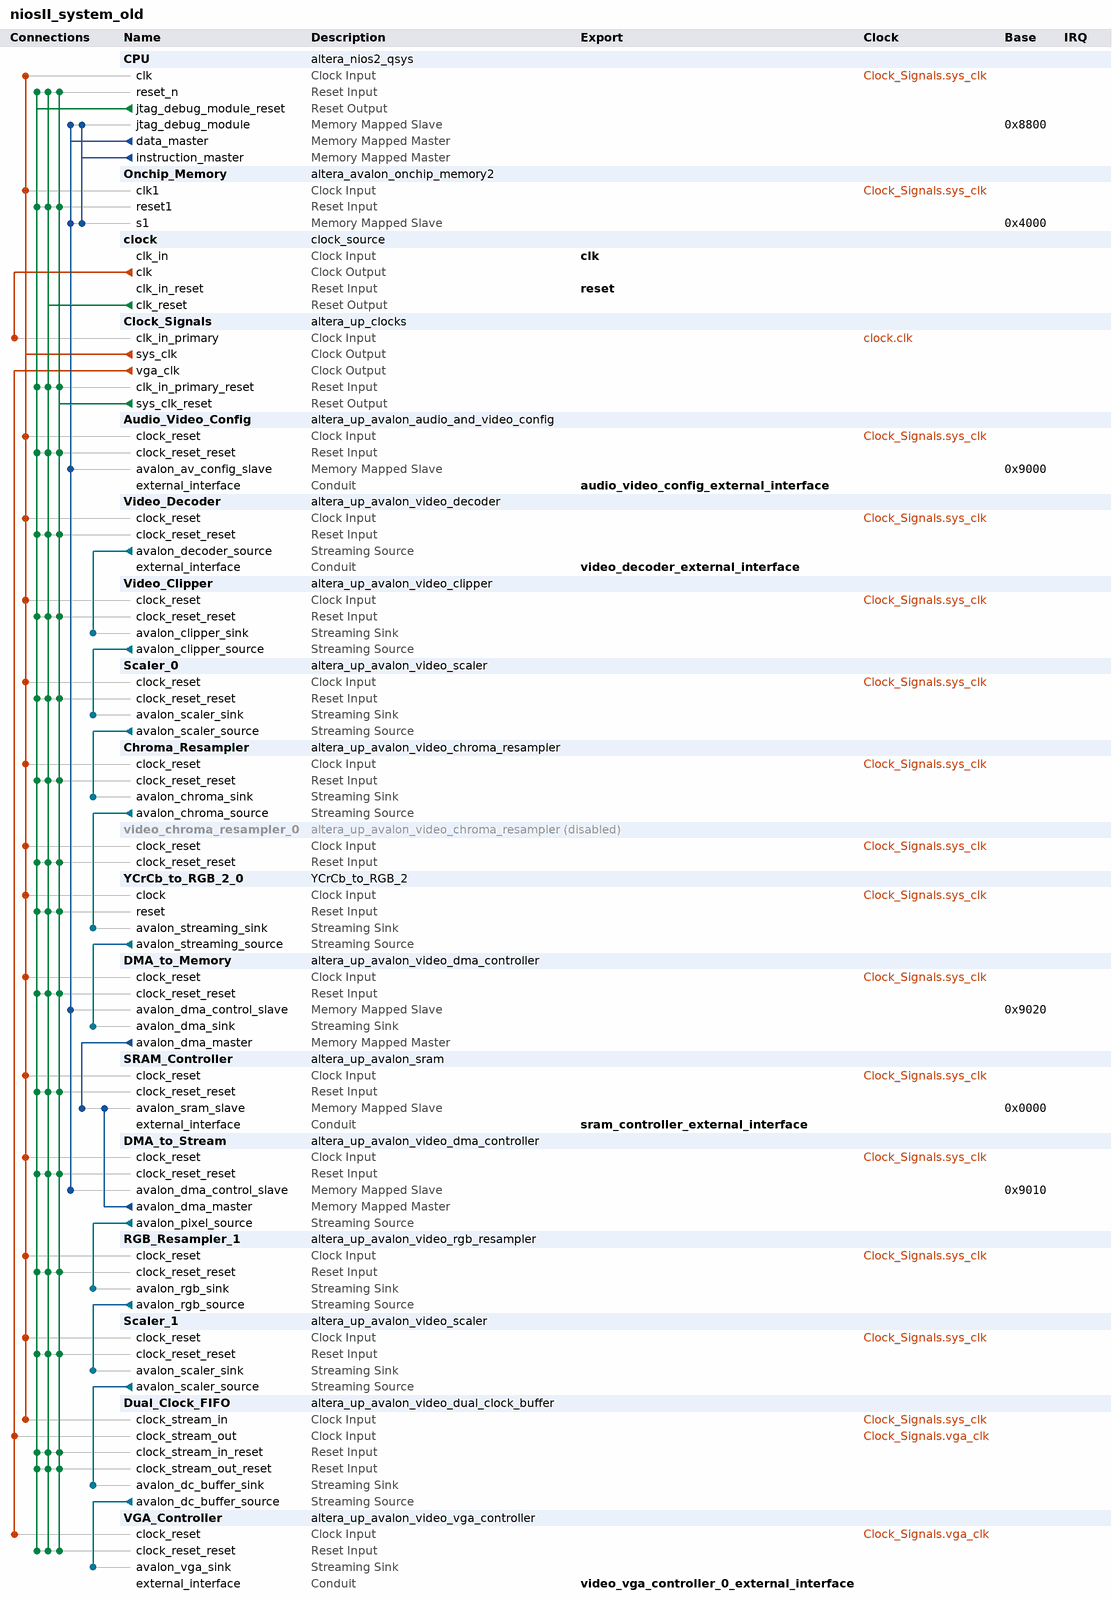
[diagram p0: system contents]
# Platform Designer (Qsys) system niosII_system_old, Cyclone II EP2C35F672C6
# Parameters at their usual value, and those the tool derives, are not listed.
package require -exact qsys 12.0
create_system niosII_system_old
set_project_property DEVICE_FAMILY {Cyclone II}
set_project_property DEVICE EP2C35F672C6

add_instance CPU altera_nios2_qsys 12.1
set_instance_parameter_value CPU resetSlave Onchip_Memory.s1
set_instance_parameter_value CPU exceptionSlave Onchip_Memory.s1
set_instance_parameter_value CPU breakSlave CPU.jtag_debug_module
set_instance_parameter_value CPU impl Tiny
set_instance_parameter_value CPU icache_size 4096

add_instance Onchip_Memory altera_avalon_onchip_memory2 12.1
set_instance_parameter_value Onchip_Memory dataWidth 32
set_instance_parameter_value Onchip_Memory dualPort false
set_instance_parameter_value Onchip_Memory initMemContent true
set_instance_parameter_value Onchip_Memory initializationFileName Onchip_Memory
set_instance_parameter_value Onchip_Memory memorySize 16384

add_instance clock clock_source 12.1
set_instance_parameter_value clock clockFrequency 50000000

add_instance Clock_Signals altera_up_clocks 12.0
set_instance_parameter_value Clock_Signals board DE2-115
set_instance_parameter_value Clock_Signals sdram_clk false
set_instance_parameter_value Clock_Signals vga_clk true
set_instance_parameter_value Clock_Signals audio_clk false
set_instance_parameter_value Clock_Signals audio_clk_freq 12.288

add_instance Audio_Video_Config altera_up_avalon_audio_and_video_config 12.0
set_instance_parameter_value Audio_Video_Config board DE2
set_instance_parameter_value Audio_Video_Config audio_in {Microphone to ADC}
set_instance_parameter_value Audio_Video_Config dac_enable false
set_instance_parameter_value Audio_Video_Config line_in_bypass false
set_instance_parameter_value Audio_Video_Config bit_length 24
set_instance_parameter_value Audio_Video_Config sampling_rate {48 kHz}

add_instance Video_Decoder altera_up_avalon_video_decoder 12.0

add_instance Video_Clipper altera_up_avalon_video_clipper 12.0
set_instance_parameter_value Video_Clipper color_bits 8
set_instance_parameter_value Video_Clipper color_planes 2

add_instance Scaler_0 altera_up_avalon_video_scaler 12.0
set_instance_parameter_value Scaler_0 width_scaling 0.5
set_instance_parameter_value Scaler_0 height_scaling 1
set_instance_parameter_value Scaler_0 width_in 640
set_instance_parameter_value Scaler_0 color_bits 8
set_instance_parameter_value Scaler_0 color_planes 2

add_instance Chroma_Resampler altera_up_avalon_video_chroma_resampler 12.0

add_instance video_chroma_resampler_0 altera_up_avalon_video_chroma_resampler 12.0
set_instance_property video_chroma_resampler_0 ENABLED false
set_instance_parameter_value video_chroma_resampler_0 input_type {Y only}

add_instance YCrCb_to_RGB_2_0 YCrCb_to_RGB_2 1.0
set_instance_parameter_value YCrCb_to_RGB_2_0 IW 23
set_instance_parameter_value YCrCb_to_RGB_2_0 OW 23
set_instance_parameter_value YCrCb_to_RGB_2_0 EIW 1
set_instance_parameter_value YCrCb_to_RGB_2_0 EOW 1

add_instance DMA_to_Memory altera_up_avalon_video_dma_controller 12.0
set_instance_parameter_value DMA_to_Memory mode {From Stream to Memory}
set_instance_parameter_value DMA_to_Memory addr_mode Consecutive
set_instance_parameter_value DMA_to_Memory start_address 0
set_instance_parameter_value DMA_to_Memory back_start_address 0
set_instance_parameter_value DMA_to_Memory width 320
set_instance_parameter_value DMA_to_Memory height 240
set_instance_parameter_value DMA_to_Memory color_bits 8
set_instance_parameter_value DMA_to_Memory color_planes 3

add_instance SRAM_Controller altera_up_avalon_sram 12.0
set_instance_parameter_value SRAM_Controller board DE2-115
set_instance_parameter_value SRAM_Controller pixel_buffer true

add_instance DMA_to_Stream altera_up_avalon_video_dma_controller 12.0
set_instance_parameter_value DMA_to_Stream mode {From Memory to Stream}
set_instance_parameter_value DMA_to_Stream addr_mode Consecutive
set_instance_parameter_value DMA_to_Stream start_address 0
set_instance_parameter_value DMA_to_Stream back_start_address 0
set_instance_parameter_value DMA_to_Stream width 320
set_instance_parameter_value DMA_to_Stream height 240
set_instance_parameter_value DMA_to_Stream color_bits 8
set_instance_parameter_value DMA_to_Stream color_planes 3

add_instance RGB_Resampler_1 altera_up_avalon_video_rgb_resampler 12.0
set_instance_parameter_value RGB_Resampler_1 input_type {24-bit RGB}
set_instance_parameter_value RGB_Resampler_1 output_type {30-bit RGB}
set_instance_parameter_value RGB_Resampler_1 alpha 1023

add_instance Scaler_1 altera_up_avalon_video_scaler 12.0
set_instance_parameter_value Scaler_1 width_scaling 2
set_instance_parameter_value Scaler_1 height_scaling 2
set_instance_parameter_value Scaler_1 width_in 320
set_instance_parameter_value Scaler_1 color_bits 10
set_instance_parameter_value Scaler_1 color_planes 3

add_instance Dual_Clock_FIFO altera_up_avalon_video_dual_clock_buffer 12.0
set_instance_parameter_value Dual_Clock_FIFO color_bits 10

add_instance VGA_Controller altera_up_avalon_video_vga_controller 12.0
set_instance_parameter_value VGA_Controller board DE2

# connections
add_connection clock.clk Clock_Signals.clk_in_primary clock
add_connection Clock_Signals.sys_clk Audio_Video_Config.clock_reset clock
add_connection Clock_Signals.sys_clk Chroma_Resampler.clock_reset clock
add_connection Clock_Signals.sys_clk CPU.clk clock
add_connection Clock_Signals.sys_clk DMA_to_Memory.clock_reset clock
add_connection Clock_Signals.sys_clk DMA_to_Stream.clock_reset clock
add_connection Clock_Signals.sys_clk Dual_Clock_FIFO.clock_stream_in clock
add_connection Clock_Signals.sys_clk Onchip_Memory.clk1 clock
add_connection Clock_Signals.sys_clk RGB_Resampler_1.clock_reset clock
add_connection Clock_Signals.sys_clk Scaler_0.clock_reset clock
add_connection Clock_Signals.sys_clk Scaler_1.clock_reset clock
add_connection Clock_Signals.sys_clk SRAM_Controller.clock_reset clock
add_connection Clock_Signals.sys_clk video_chroma_resampler_0.clock_reset clock
add_connection Clock_Signals.sys_clk Video_Clipper.clock_reset clock
add_connection Clock_Signals.sys_clk Video_Decoder.clock_reset clock
add_connection Clock_Signals.sys_clk YCrCb_to_RGB_2_0.clock clock
add_connection Clock_Signals.vga_clk Dual_Clock_FIFO.clock_stream_out clock
add_connection Clock_Signals.vga_clk VGA_Controller.clock_reset clock
add_connection clock.clk_reset Audio_Video_Config.clock_reset_reset reset
add_connection clock.clk_reset Chroma_Resampler.clock_reset_reset reset
add_connection clock.clk_reset Clock_Signals.clk_in_primary_reset reset
add_connection clock.clk_reset CPU.reset_n reset
add_connection clock.clk_reset DMA_to_Memory.clock_reset_reset reset
add_connection clock.clk_reset DMA_to_Stream.clock_reset_reset reset
add_connection clock.clk_reset Dual_Clock_FIFO.clock_stream_in_reset reset
add_connection clock.clk_reset Dual_Clock_FIFO.clock_stream_out_reset reset
add_connection clock.clk_reset Onchip_Memory.reset1 reset
add_connection clock.clk_reset RGB_Resampler_1.clock_reset_reset reset
add_connection clock.clk_reset Scaler_0.clock_reset_reset reset
add_connection clock.clk_reset Scaler_1.clock_reset_reset reset
add_connection clock.clk_reset SRAM_Controller.clock_reset_reset reset
add_connection clock.clk_reset VGA_Controller.clock_reset_reset reset
add_connection clock.clk_reset video_chroma_resampler_0.clock_reset_reset reset
add_connection clock.clk_reset Video_Clipper.clock_reset_reset reset
add_connection clock.clk_reset Video_Decoder.clock_reset_reset reset
add_connection clock.clk_reset YCrCb_to_RGB_2_0.reset reset
add_connection Clock_Signals.sys_clk_reset Audio_Video_Config.clock_reset_reset reset
add_connection Clock_Signals.sys_clk_reset Chroma_Resampler.clock_reset_reset reset
add_connection Clock_Signals.sys_clk_reset Clock_Signals.clk_in_primary_reset reset
add_connection Clock_Signals.sys_clk_reset CPU.reset_n reset
add_connection Clock_Signals.sys_clk_reset DMA_to_Memory.clock_reset_reset reset
add_connection Clock_Signals.sys_clk_reset DMA_to_Stream.clock_reset_reset reset
add_connection Clock_Signals.sys_clk_reset Dual_Clock_FIFO.clock_stream_in_reset reset
add_connection Clock_Signals.sys_clk_reset Dual_Clock_FIFO.clock_stream_out_reset reset
add_connection Clock_Signals.sys_clk_reset Onchip_Memory.reset1 reset
add_connection Clock_Signals.sys_clk_reset RGB_Resampler_1.clock_reset_reset reset
add_connection Clock_Signals.sys_clk_reset Scaler_0.clock_reset_reset reset
add_connection Clock_Signals.sys_clk_reset Scaler_1.clock_reset_reset reset
add_connection Clock_Signals.sys_clk_reset SRAM_Controller.clock_reset_reset reset
add_connection Clock_Signals.sys_clk_reset VGA_Controller.clock_reset_reset reset
add_connection Clock_Signals.sys_clk_reset video_chroma_resampler_0.clock_reset_reset reset
add_connection Clock_Signals.sys_clk_reset Video_Clipper.clock_reset_reset reset
add_connection Clock_Signals.sys_clk_reset Video_Decoder.clock_reset_reset reset
add_connection Clock_Signals.sys_clk_reset YCrCb_to_RGB_2_0.reset reset
add_connection CPU.jtag_debug_module_reset Audio_Video_Config.clock_reset_reset reset
add_connection CPU.jtag_debug_module_reset Chroma_Resampler.clock_reset_reset reset
add_connection CPU.jtag_debug_module_reset Clock_Signals.clk_in_primary_reset reset
add_connection CPU.jtag_debug_module_reset CPU.reset_n reset
add_connection CPU.jtag_debug_module_reset DMA_to_Memory.clock_reset_reset reset
add_connection CPU.jtag_debug_module_reset DMA_to_Stream.clock_reset_reset reset
add_connection CPU.jtag_debug_module_reset Dual_Clock_FIFO.clock_stream_in_reset reset
add_connection CPU.jtag_debug_module_reset Dual_Clock_FIFO.clock_stream_out_reset reset
add_connection CPU.jtag_debug_module_reset Onchip_Memory.reset1 reset
add_connection CPU.jtag_debug_module_reset RGB_Resampler_1.clock_reset_reset reset
add_connection CPU.jtag_debug_module_reset Scaler_0.clock_reset_reset reset
add_connection CPU.jtag_debug_module_reset Scaler_1.clock_reset_reset reset
add_connection CPU.jtag_debug_module_reset SRAM_Controller.clock_reset_reset reset
add_connection CPU.jtag_debug_module_reset VGA_Controller.clock_reset_reset reset
add_connection CPU.jtag_debug_module_reset video_chroma_resampler_0.clock_reset_reset reset
add_connection CPU.jtag_debug_module_reset Video_Clipper.clock_reset_reset reset
add_connection CPU.jtag_debug_module_reset Video_Decoder.clock_reset_reset reset
add_connection CPU.jtag_debug_module_reset YCrCb_to_RGB_2_0.reset reset
add_connection CPU.data_master Audio_Video_Config.avalon_av_config_slave avalon
set_connection_parameter_value CPU.data_master/Audio_Video_Config.avalon_av_config_slave baseAddress 0x9000
add_connection CPU.data_master CPU.jtag_debug_module avalon
set_connection_parameter_value CPU.data_master/CPU.jtag_debug_module baseAddress 0x8800
add_connection CPU.data_master DMA_to_Memory.avalon_dma_control_slave avalon
set_connection_parameter_value CPU.data_master/DMA_to_Memory.avalon_dma_control_slave baseAddress 0x9020
add_connection CPU.data_master DMA_to_Stream.avalon_dma_control_slave avalon
set_connection_parameter_value CPU.data_master/DMA_to_Stream.avalon_dma_control_slave baseAddress 0x9010
add_connection CPU.data_master Onchip_Memory.s1 avalon
set_connection_parameter_value CPU.data_master/Onchip_Memory.s1 baseAddress 0x4000
add_connection CPU.instruction_master CPU.jtag_debug_module avalon
set_connection_parameter_value CPU.instruction_master/CPU.jtag_debug_module baseAddress 0x8800
add_connection CPU.instruction_master Onchip_Memory.s1 avalon
set_connection_parameter_value CPU.instruction_master/Onchip_Memory.s1 baseAddress 0x4000
add_connection DMA_to_Memory.avalon_dma_master SRAM_Controller.avalon_sram_slave avalon
set_connection_parameter_value DMA_to_Memory.avalon_dma_master/SRAM_Controller.avalon_sram_slave baseAddress 0x0000
add_connection DMA_to_Stream.avalon_dma_master SRAM_Controller.avalon_sram_slave avalon
set_connection_parameter_value DMA_to_Stream.avalon_dma_master/SRAM_Controller.avalon_sram_slave baseAddress 0x0000
add_connection Chroma_Resampler.avalon_chroma_source YCrCb_to_RGB_2_0.avalon_streaming_sink avalon_streaming
add_connection DMA_to_Stream.avalon_pixel_source RGB_Resampler_1.avalon_rgb_sink avalon_streaming
add_connection Dual_Clock_FIFO.avalon_dc_buffer_source VGA_Controller.avalon_vga_sink avalon_streaming
add_connection RGB_Resampler_1.avalon_rgb_source Scaler_1.avalon_scaler_sink avalon_streaming
add_connection Scaler_0.avalon_scaler_source Chroma_Resampler.avalon_chroma_sink avalon_streaming
add_connection Scaler_1.avalon_scaler_source Dual_Clock_FIFO.avalon_dc_buffer_sink avalon_streaming
add_connection Video_Clipper.avalon_clipper_source Scaler_0.avalon_scaler_sink avalon_streaming
add_connection Video_Decoder.avalon_decoder_source Video_Clipper.avalon_clipper_sink avalon_streaming
add_connection YCrCb_to_RGB_2_0.avalon_streaming_source DMA_to_Memory.avalon_dma_sink avalon_streaming

# exported interfaces
add_interface clk clock sink
set_interface_property clk EXPORT_OF clock.clk_in
add_interface reset reset sink
set_interface_property reset EXPORT_OF clock.clk_in_reset
add_interface video_decoder_external_interface conduit end
set_interface_property video_decoder_external_interface EXPORT_OF Video_Decoder.external_interface
add_interface sram_controller_external_interface conduit end
set_interface_property sram_controller_external_interface EXPORT_OF SRAM_Controller.external_interface
add_interface video_vga_controller_0_external_interface conduit end
set_interface_property video_vga_controller_0_external_interface EXPORT_OF VGA_Controller.external_interface
add_interface audio_video_config_external_interface conduit end
set_interface_property audio_video_config_external_interface EXPORT_OF Audio_Video_Config.external_interface

save_system niosII_system_old.qsys
